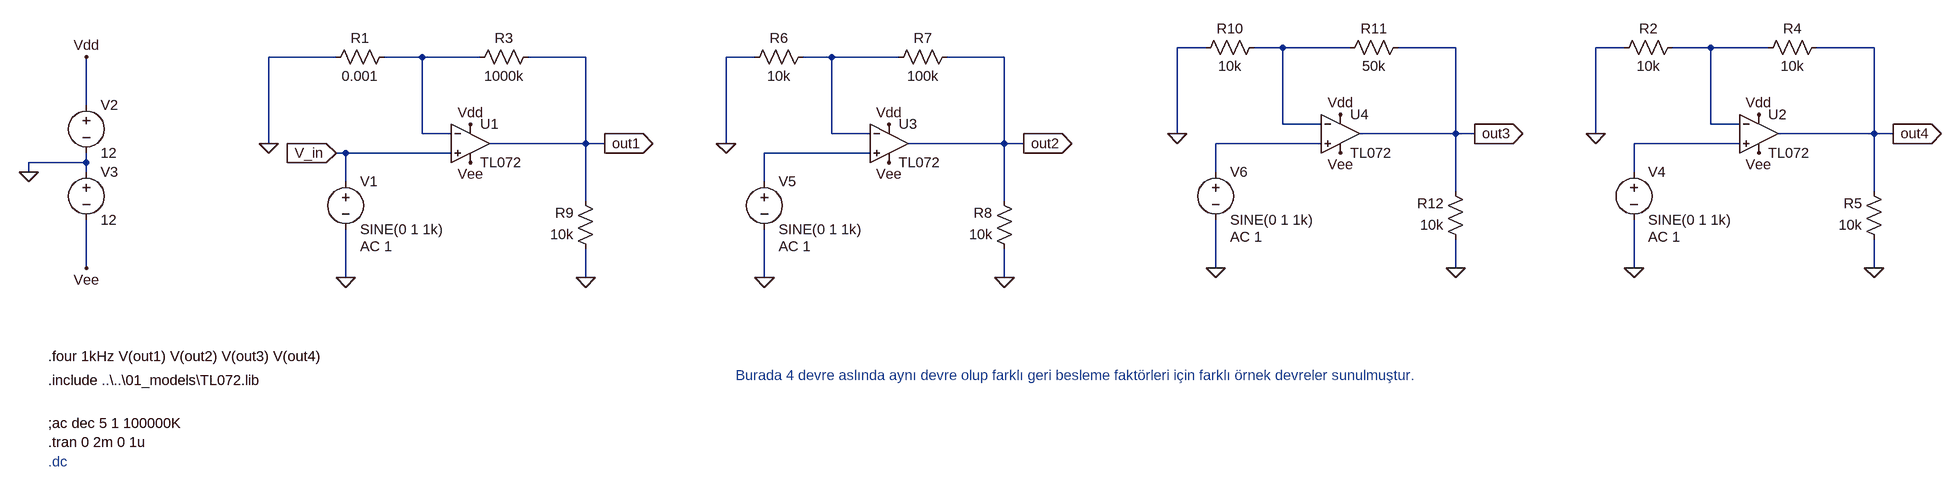
[diagram p0: schematic fb_volser.asc]
fb_volser.asc, the LTspice schematic file:
Version 4
SHEET 1 3248 932
WIRE 1904 -32 1856 -32
WIRE 2032 -32 1984 -32
WIRE 2144 -32 2032 -32
WIRE 2320 -32 2224 -32
WIRE 2688 -32 2640 -32
WIRE 2832 -32 2768 -32
WIRE 2928 -32 2832 -32
WIRE 3104 -32 3008 -32
WIRE 384 -16 272 -16
WIRE 528 -16 464 -16
WIRE 624 -16 528 -16
WIRE 800 -16 704 -16
WIRE 1152 -16 1104 -16
WIRE 1280 -16 1232 -16
WIRE 1392 -16 1280 -16
WIRE 1568 -16 1472 -16
WIRE -32 64 -32 -16
WIRE 2032 96 2032 -32
WIRE 2096 96 2032 96
WIRE 2832 96 2832 -32
WIRE 2880 96 2832 96
WIRE 528 112 528 -16
WIRE 576 112 528 112
WIRE 1280 112 1280 -16
WIRE 1344 112 1280 112
WIRE 1856 112 1856 -32
WIRE 2320 112 2320 -32
WIRE 2320 112 2160 112
WIRE 2352 112 2320 112
WIRE 2640 112 2640 -32
WIRE 3104 112 3104 -32
WIRE 3104 112 2944 112
WIRE 3136 112 3104 112
WIRE 272 128 272 -16
WIRE 800 128 800 -16
WIRE 800 128 640 128
WIRE 832 128 800 128
WIRE 1104 128 1104 -16
WIRE 1568 128 1568 -16
WIRE 1568 128 1408 128
WIRE 1600 128 1568 128
WIRE 2096 128 1920 128
WIRE 2880 128 2704 128
WIRE 400 144 384 144
WIRE 576 144 400 144
WIRE 1344 144 1168 144
WIRE -32 160 -32 144
WIRE -32 160 -128 160
WIRE -128 176 -128 160
WIRE -32 176 -32 160
WIRE 1920 176 1920 128
WIRE 2704 176 2704 128
WIRE 400 192 400 144
WIRE 1168 192 1168 144
WIRE 2320 208 2320 112
WIRE 3104 208 3104 112
WIRE 800 224 800 128
WIRE 1568 224 1568 128
WIRE -32 336 -32 256
WIRE 1920 336 1920 256
WIRE 2320 336 2320 288
WIRE 2704 336 2704 256
WIRE 3104 336 3104 288
WIRE 400 352 400 272
WIRE 800 352 800 304
WIRE 1168 352 1168 272
WIRE 1568 352 1568 304
FLAG -128 176 0
FLAG -32 -16 Vdd
FLAG -32 336 Vee
FLAG 2640 112 0
FLAG 2704 336 0
FLAG 3104 336 0
FLAG 2912 80 Vdd
FLAG 2912 144 Vee
FLAG 1104 128 0
FLAG 1168 352 0
FLAG 1568 352 0
FLAG 1376 96 Vdd
FLAG 1376 160 Vee
FLAG 272 128 0
FLAG 400 352 0
FLAG 800 352 0
FLAG 608 96 Vdd
FLAG 608 160 Vee
FLAG 1856 112 0
FLAG 1920 336 0
FLAG 2320 336 0
FLAG 2128 80 Vdd
FLAG 2128 144 Vee
FLAG 384 144 V_in
IOPIN 384 144 In
FLAG 832 128 out1
IOPIN 832 128 Out
FLAG 1600 128 out2
IOPIN 1600 128 Out
FLAG 2352 112 out3
IOPIN 2352 112 Out
FLAG 3136 112 out4
IOPIN 3136 112 Out
SYMBOL voltage -32 48 R0
WINDOW 123 0 0 Left 0
WINDOW 39 0 0 Left 0
SYMATTR InstName V2
SYMATTR Value 12
SYMBOL voltage -32 160 R0
WINDOW 123 0 0 Left 0
WINDOW 39 0 0 Left 0
SYMATTR InstName V3
SYMATTR Value 12
SYMBOL res 2784 -48 R90
WINDOW 0 0 56 VBottom 2
WINDOW 3 32 56 VTop 2
SYMATTR InstName R2
SYMATTR Value 10k
SYMBOL res 3024 -48 R90
WINDOW 0 0 56 VBottom 2
WINDOW 3 32 56 VTop 2
SYMATTR InstName R4
SYMATTR Value 10k
SYMBOL res 3120 304 R180
WINDOW 0 36 76 Left 2
WINDOW 3 36 40 Left 2
SYMATTR InstName R5
SYMATTR Value 10k
SYMBOL voltage 2704 160 R0
WINDOW 123 24 124 Left 2
WINDOW 39 0 0 Left 0
SYMATTR Value2 AC 1
SYMATTR InstName V4
SYMATTR Value SINE(0 1 1k)
SYMBOL OpAmps\\opamp2 2912 48 R0
SYMATTR InstName U2
SYMATTR Value TL072
SYMBOL res 1248 -32 R90
WINDOW 0 0 56 VBottom 2
WINDOW 3 32 56 VTop 2
SYMATTR InstName R6
SYMATTR Value 10k
SYMBOL res 1488 -32 R90
WINDOW 0 0 56 VBottom 2
WINDOW 3 32 56 VTop 2
SYMATTR InstName R7
SYMATTR Value 100k
SYMBOL res 1584 320 R180
WINDOW 0 36 76 Left 2
WINDOW 3 36 40 Left 2
SYMATTR InstName R8
SYMATTR Value 10k
SYMBOL voltage 1168 176 R0
WINDOW 123 24 124 Left 2
WINDOW 39 0 0 Left 0
SYMATTR Value2 AC 1
SYMATTR InstName V5
SYMATTR Value SINE(0 1 1k)
SYMBOL OpAmps\\opamp2 1376 64 R0
SYMATTR InstName U3
SYMATTR Value TL072
SYMBOL res 480 -32 R90
WINDOW 0 0 56 VBottom 2
WINDOW 3 32 56 VTop 2
SYMATTR InstName R1
SYMATTR Value 0.001
SYMBOL res 720 -32 R90
WINDOW 0 0 56 VBottom 2
WINDOW 3 32 56 VTop 2
SYMATTR InstName R3
SYMATTR Value 1000k
SYMBOL res 816 320 R180
WINDOW 0 36 76 Left 2
WINDOW 3 36 40 Left 2
SYMATTR InstName R9
SYMATTR Value 10k
SYMBOL voltage 400 176 R0
WINDOW 123 24 124 Left 2
WINDOW 39 0 0 Left 0
SYMATTR Value2 AC 1
SYMATTR InstName V1
SYMATTR Value SINE(0 1 1k)
SYMBOL OpAmps\\opamp2 608 64 R0
SYMATTR InstName U1
SYMATTR Value TL072
SYMBOL res 2000 -48 R90
WINDOW 0 0 56 VBottom 2
WINDOW 3 32 56 VTop 2
SYMATTR InstName R10
SYMATTR Value 10k
SYMBOL res 2240 -48 R90
WINDOW 0 0 56 VBottom 2
WINDOW 3 32 56 VTop 2
SYMATTR InstName R11
SYMATTR Value 50k
SYMBOL res 2336 304 R180
WINDOW 0 36 76 Left 2
WINDOW 3 36 40 Left 2
SYMATTR InstName R12
SYMATTR Value 10k
SYMBOL voltage 1920 160 R0
WINDOW 123 24 124 Left 2
WINDOW 39 0 0 Left 0
SYMATTR Value2 AC 1
SYMATTR InstName V6
SYMATTR Value SINE(0 1 1k)
SYMBOL OpAmps\\opamp2 2128 48 R0
SYMATTR InstName U4
SYMATTR Value TL072
TEXT -96 600 Left 2 !;ac dec 5 1 100000K
TEXT -96 632 Left 2 !.tran 0 2m 0 1u
TEXT -96 664 Left 2 ;.dc
TEXT -96 488 Left 2 !.four 1kHz V(out1) V(out2) V(out3) V(out4)
TEXT -96 528 Left 2 !.include ..\\..\\01_models\\TL072.lib
TEXT 1120 520 Left 2 ;Burada 4 devre aslında aynı devre olup farklı geri besleme faktörleri için farklı örnek devreler sunulmuştur.

The netlist it stands for:
* fb_volser.asc
V2 Vdd 0 12
V3 0 Vee 12
R2 N002 0 10k
R4 out4 N002 10k
R5 0 out4 10k
V4 N006 0 SINE(0 1 1k) AC 1
XU2 N006 N002 Vdd Vee out4 TL072  ; pins In+ In- V+ V- OUT
R6 N004 0 10k
R7 out2 N004 100k
R8 0 out2 10k
V5 N007 0 SINE(0 1 1k) AC 1
XU3 N007 N004 Vdd Vee out2 TL072  ; pins In+ In- V+ V- OUT
R1 N003 0 0.001
R3 out1 N003 1000k
R9 0 out1 10k
V1 V_in 0 SINE(0 1 1k) AC 1
XU1 V_in N003 Vdd Vee out1 TL072  ; pins In+ In- V+ V- OUT
R10 N001 0 10k
R11 out3 N001 50k
R12 0 out3 10k
V6 N005 0 SINE(0 1 1k) AC 1
XU4 N005 N001 Vdd Vee out3 TL072  ; pins In+ In- V+ V- OUT
;ac dec 5 1 100000K
.tran 0 2m 0 1u
* .dc
.four 1kHz V(out1) V(out2) V(out3) V(out4)
.include ..\..\01_models\TL072.lib
* Burada 4 devre aslında aynı devre olup farklı geri besleme faktörleri için farklı örnek devreler sunulmuştur.
.backanno
.end